# Altium schematic sheet PSU_TPS75501_3V8.SchDoc: 3.8V Power Supply
size A4; Organization: Altium Limited.; Address1: Level 3, 12a Rodborough Rd; Address2: Frenchs Forest 2086; Address3: NSW; Address4: AUSTRALIA; DocumentNumber: 5; Revision: 6; SheetNumber: 6; SheetTotal: 12
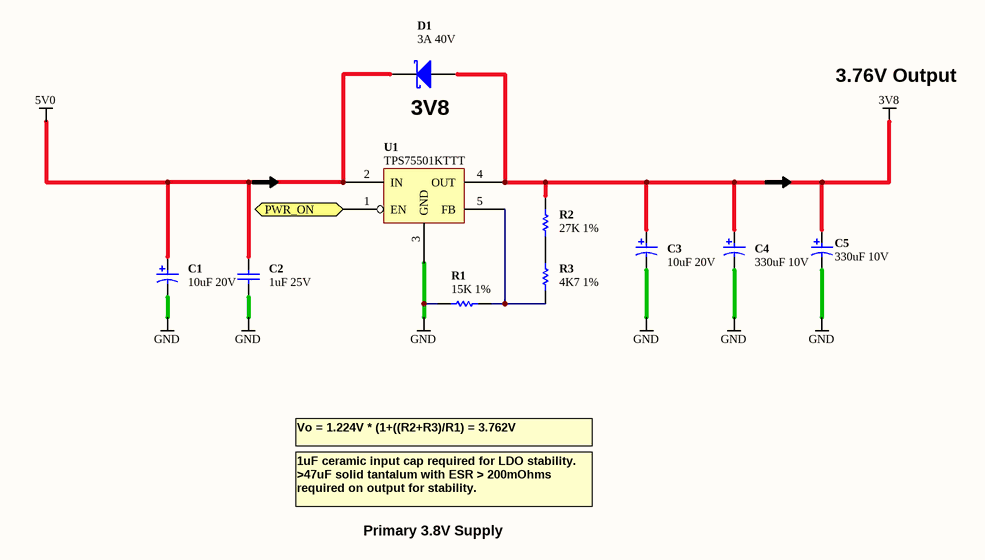
[diagram p0: PSU_TPS75501_3V8.SchDoc]

## Parts
C1  10uF 20V  [CAPC3528-STAR]
C2  1uF 25V  [CAPC3216-STAR]
C3  10uF 20V  [CAPC3528-STAR]
C4  330uF 10V  [CAPC7343-STAR]
C5  330uF 10V  [CAPC7343-STAR]
D1  3A 40V  [DIOM5027]
R1  15K 1%  [RESC1005-STAR]
R2  27K 1%  [RESC1005-STAR]
R3  4K7 1%  [RESC1005-STAR]
U1  TPS75501KTTT  [TO-263]

## Ports
PWR_ON

## Nets
3V8: C3.1 C4.1 C5.1 D1.1(A) R2.2 U1.4(OUT)
5V0: C1.1 C2.1 D1.2(K) U1.2(IN)
GND: C1.2 C2.2 C3.2 C4.2 C5.2 R1.1 U1.3(GND)
PWR_ON: U1.1(EN) ; port PWR_ON
NetR1_2: R1.2 R3.1 U1.5(FB)
NetR2_1: R2.1 R3.2

## Notes on the sheet
- (near D1) 3V8
- 3.76V Output
- Vo = 1.224V * (1+((R2+R3)/R1) = 3.762V
- 1uF ceramic input cap required for LDO stability.
  >47uF solid tantalum with ESR > 200mOhms required on output for stability.
- Primary 3.8V Supply
- Sheet Title
- Project Title
- Size:
- Date:
- A4
- Assy:
- Time:
- Revision:
- Sheet
- of
- File:

## Library data of the parts
C1 C3 = D-101-0007: Capacitor, Tantalum, 10uF 10% 20V MCCT-B (3528); Polarity: Polarized; Category: Capacitor; Capacitance: 10 uF; Mounting Technology: Surface Mount; Rated Voltage: 20 V; Status: Production; Technology: Tantalum; Tolerance: 10 %
C2 = D-101-0027: Capacitor, Ceramic, 1uF 10% 25V 1206 (3216) X7R; Polarity: Non-Polarized; Capacitance: 1 uF; Dielectric: X7R; Mounting Technology: Surface Mount; Rated Voltage: 25 V; Status: Production; Technology: Ceramic; Tolerance: 10 %; Category: Capacitor
C4 C5 = D-101-0012: Capacitor, Tantalum, 330uF 20% 10V, LOW ESR 6mR MCCT-D (7343-31); Polarity: Polarized; Category: Capacitor; Capacitance: 330 uF; Mounting Technology: Surface Mount; Rated Voltage: 10 V; Status: Unreleased; Technology: Tantalum; Tolerance: 20 %
D1 = D-151-0000: Schottky Diode, 3A 40V; Category: Diode-Schottky; Status: Production
R1 = D-100-0125: Resistor, 15K 1% 0402 (1005); Power Rating: 63 mW; Category: Resistor; Mounting Technology: Surface Mount; Resistance: 15 K; Status: Production; Tolerance: 1 %
R2 = D-100-0109: Resistor, 27K 1% 0402 (1005); Power Rating: 63 mW; Category: Resistor; Mounting Technology: Surface Mount; Resistance: 27 K; Status: Production; Tolerance: 1 %
R3 = D-100-0088: Resistor, 4K7 1% 0402 (1005); Power Rating: 63 mW; Resistance: 4.7 K; Category: Resistor; Mounting Technology: Surface Mount; Status: Production; Tolerance: 1 %
U1 = D-204-0014: TPS75501KTTT, 5A, Low Dropout, Adjustable, Linear Voltage Regulator, TO-263; Max Input Voltage: 6 V; Max Output Voltage: 5.5 V; Min Input Voltage: 1 V; Supply Voltage: mV; Max Output Current: 5 A; Min Output Voltage: 1 V; Mounting Technology: Surface Mount; Status: Production; Temperature Range: -40 to +125; Category: IC-Power